# EAGLE design capstoneIO (EAGLE 9.6.2)
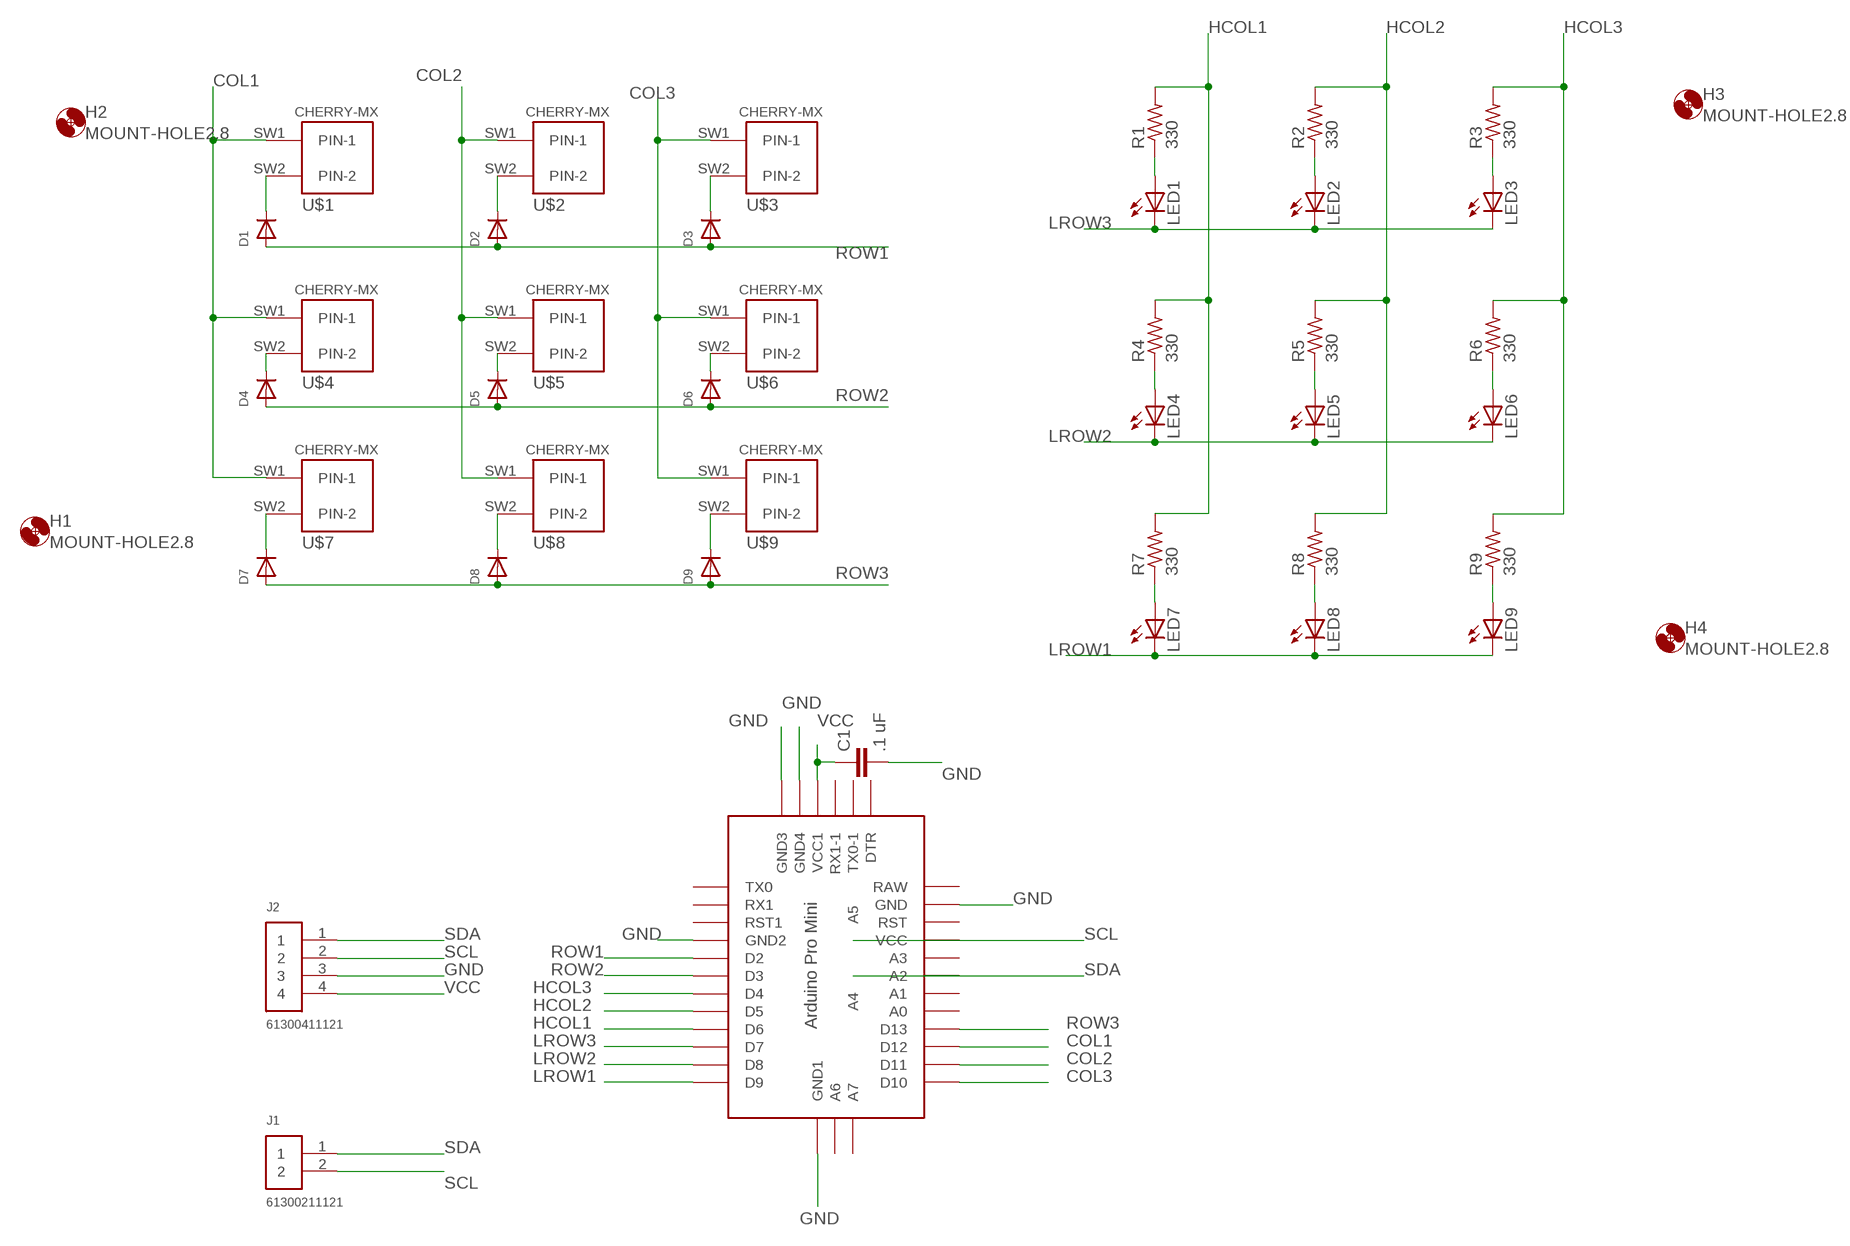
[diagram p0: schematic, sheet 1]

## Parts
C1  .1 uF  C-EU075-032X103-AARON  [C075-032X103-AARON]
D1  DIODEDO-1N4148  [DO-1N4148]
D2  DIODEDO-1N4148  [DO-1N4148]
D3  DIODEDO-1N4148  [DO-1N4148]
D4  DIODEDO-1N4148  [DO-1N4148]
D5  DIODEDO-1N4148  [DO-1N4148]
D6  DIODEDO-1N4148  [DO-1N4148]
D7  DIODEDO-1N4148  [DO-1N4148]
D8  DIODEDO-1N4148  [DO-1N4148]
D9  DIODEDO-1N4148  [DO-1N4148]
H1  MOUNT-HOLE2.8  [2,8]
H2  MOUNT-HOLE2.8  [2,8]
H3  MOUNT-HOLE2.8  [2,8]
H4  MOUNT-HOLE2.8  [2,8]
J1  61300211121  [61300211121]
J2  61300411121  [61300411121]
LED1  LED5MM  [LED5MM]
LED2  LED5MM  [LED5MM]
LED3  LED5MM  [LED5MM]
LED4  LED5MM  [LED5MM]
LED5  LED5MM  [LED5MM]
LED6  LED5MM  [LED5MM]
LED7  LED5MM  [LED5MM]
LED8  LED5MM  [LED5MM]
LED9  LED5MM  [LED5MM]
R1  330  R-US_0204/7  [0204/7]
R2  330  R-US_0204/7  [0204/7]
R3  330  R-US_0204/7  [0204/7]
R4  330  R-US_0204/7  [0204/7]
R5  330  R-US_0204/7  [0204/7]
R6  330  R-US_0204/7  [0204/7]
R7  330  R-US_0204/7  [0204/7]
R8  330  R-US_0204/7  [0204/7]
R9  330  R-US_0204/7  [0204/7]
U$1  CHERRY-MX  [CHERRY-MX]
U$2  CHERRY-MX  [CHERRY-MX]
U$3  CHERRY-MX  [CHERRY-MX]
U$4  CHERRY-MX  [CHERRY-MX]
U$5  CHERRY-MX  [CHERRY-MX]
U$6  CHERRY-MX  [CHERRY-MX]
U$7  CHERRY-MX  [CHERRY-MX]
U$8  CHERRY-MX  [CHERRY-MX]
U$9  CHERRY-MX  [CHERRY-MX]
U$10  ABK-PRO-MINI  [ABK-PRO-MINI]

## Nets
COL1: U$1.SW1(PIN-1) U$4.SW1(PIN-1) U$7.SW1(PIN-1) U$10.D12
COL2: U$2.SW1(PIN-1) U$5.SW1(PIN-1) U$8.SW1(PIN-1) U$10.D11
COL3: U$3.SW1(PIN-1) U$6.SW1(PIN-1) U$9.SW1(PIN-1) U$10.D10
GND: C1.2 J2.3 U$10.GND U$10.GND1(GND2) U$10.GND2(GND3) U$10.GND3(GND4) U$10.GND4(GND1)
HCOL1: R1.2 R4.2 R7.2 U$10.D6
HCOL2: R2.2 R5.2 R8.2 U$10.D5
HCOL3: R3.2 R6.2 R9.2 U$10.D4
LROW1: LED7.K(C) LED8.K(C) LED9.K(C) U$10.D9
LROW2: LED4.K(C) LED5.K(C) LED6.K(C) U$10.D8
LROW3: LED1.K(C) LED2.K(C) LED3.K(C) U$10.D7
N$1: LED1.A R1.1
N$2: LED2.A R2.1
N$3: LED3.A R3.1
N$4: D1.C U$1.SW2(PIN-2)
N$5: LED4.A R4.1
N$6: D3.C U$3.SW2(PIN-2)
N$7: D2.C U$2.SW2(PIN-2)
N$8: D4.C U$4.SW2(PIN-2)
N$9: D5.C U$5.SW2(PIN-2)
N$10: D6.C U$6.SW2(PIN-2)
N$11: LED5.A R5.1
N$12: D7.C U$7.SW2(PIN-2)
N$13: D8.C U$8.SW2(PIN-2)
N$14: D9.C U$9.SW2(PIN-2)
N$15: LED6.A R6.1
N$16: LED7.A R7.1
N$17: LED8.A R8.1
N$18: LED9.A R9.1
ROW1: D1.A D2.A D3.A U$10.D2
ROW2: D4.A D5.A D6.A U$10.D3
ROW3: D7.A D8.A D9.A U$10.D13
SCL: J1.2 J2.2 U$10.A5
SDA: J1.1 J2.1 U$10.A4
VCC: C1.1 J2.4 U$10.VCC1
Unconnected: U$10.A0 U$10.A1 U$10.A2 U$10.A3 U$10.A6 U$10.A7 U$10.DTR U$10.RAW U$10.RST U$10.RST1 U$10.RX1 U$10.RX1-1 U$10.TX0 U$10.TX0-1 U$10.VCC

## Library data of the parts
C1 = aaroncaps:C-EU: CAPACITOR, European symbol
D1-D9 = adafruit:DIODE: Diode SMADIODE - SMA Surface Mount Package 20V 1A Schottky Diode Digikey: 641-1014-6-ND DO-1N4148 - Through Hole Small Current Diode SOD-123 20V 1 A (.5mV Vf) Schottky Diode - Digikey: MBRX120TPMSCT-ND SOD-323 10V 570mA (.38mV Vf, 3ns) Schottky Diode - Digikey: ZLLS410CT-ND SOD-523 30V 30mA Schottky Diode (RB751S-40TE61) - Digikey: RB751S-40TE61CT-ND SOT23-R/W - SOT23 Package (R = Solder Paste/Reflow Ovens, W = Hand-Soldering) BAT54Film 40V 300mA - Digikey: 497-7162-1-ND
H1-H4 = holes:MOUNT-HOLE: MOUNTING HOLE with drill center marker
J1 = Headers:61300211121: CONN HEADER VERT 2POS 2.54MM Manufacturer's datasheet <https://katalog.we-online.de/em/datasheet/6130xx11121.pdf>; CREATED_BY: PCBLayout.com; DIGI_KEY_PART_NUMBER: 732-5315-ND; MANUFACTURER: Wurth Electronics Inc.; MPN: 61300211121
J2 = Headers:61300411121: CONN HEADER VERT 4POS 2.54MM Manufacturer's datasheet <https://katalog.we-online.de/em/datasheet/6130xx11121.pdf>; CREATED_BY: PCBLayout.com; DIGI_KEY_PART_NUMBER: 732-5317-ND; MANUFACTURER: Wurth Electronics Inc.; MPN: 61300411121
LED1-LED9 = adafruit:LED: LED OSRAM: - CHIPLED LG R971, LG N971, LY N971, LG Q971, LY Q971, LO R971, LY R971 LH N974, LH R974 LS Q976, LO Q976, LY Q976 LO Q996 - Hyper CHIPLED LW Q18S LB Q993, LB Q99A, LB R99A - SideLED LS A670, LO A670, LY A670, LG A670, LP A670 LB A673, LV A673, LT A673, LW A673 LH A674 LY A675 LS A676, LA A676, LO A676, LY A676, LW A676 LS A679, LY A679, LG A679 - Hyper Micro SIDELED® LS Y876, LA Y876, LO Y876, LY Y876 LT Y87S - SmartLED LW L88C, LW L88S LB L89C, LB L89S, LG L890 LS L89K, LO L89K, LY L89K LS L896, LA L896, LO L896, LY L896 - TOPLED LS T670, LO T670, LY T670, LG T670, LP T670 LSG T670, LSP T670, LSY T670, LOP T670, LYG T670 LG T671, LOG T671, LSG T671 LB T673, LV T673, LT T673, LW T673 LH T674 LS T676, LA T676, LO T676, LY T676, LB T676, LH T676, LSB T676, LW T676 LB T67C, LV T67C, LT T67C, LS T67K, LO T67K, LY T67K, LW E67C LS E67B, LA E67B, LO E67B, LY E67B, LB E67C, LV E67C, LT E67C LW T67C LS T679, LY T679, LG T679 LS T770, LO T770, LY T770, LG T770, LP T770 LB T773, LV T773, LT T773, LW T773 LH T774 LS E675, LA E675, LY E675, LS T675 LS T776, LA T776, LO T776, LY T776, LB T776 LHGB T686 LT T68C, LB T68C - Hyper Mini TOPLED® LB M676 - Mini TOPLED Santana® LG M470 LS M47K, LO M47K, LY M47K Source: http://www.osram.convergy.de/
R1-R9 = rcl:R-US_: RESISTOR, American symbol; SPICEPREFIX: R
U$1-U$9 = cherrymx:CHERRY-MX: Cherry MX series keyswitch
U$10 = Arduino-clone:ABK-PRO-MINI: ABK Pro-Mini Arduino Clone

## Board
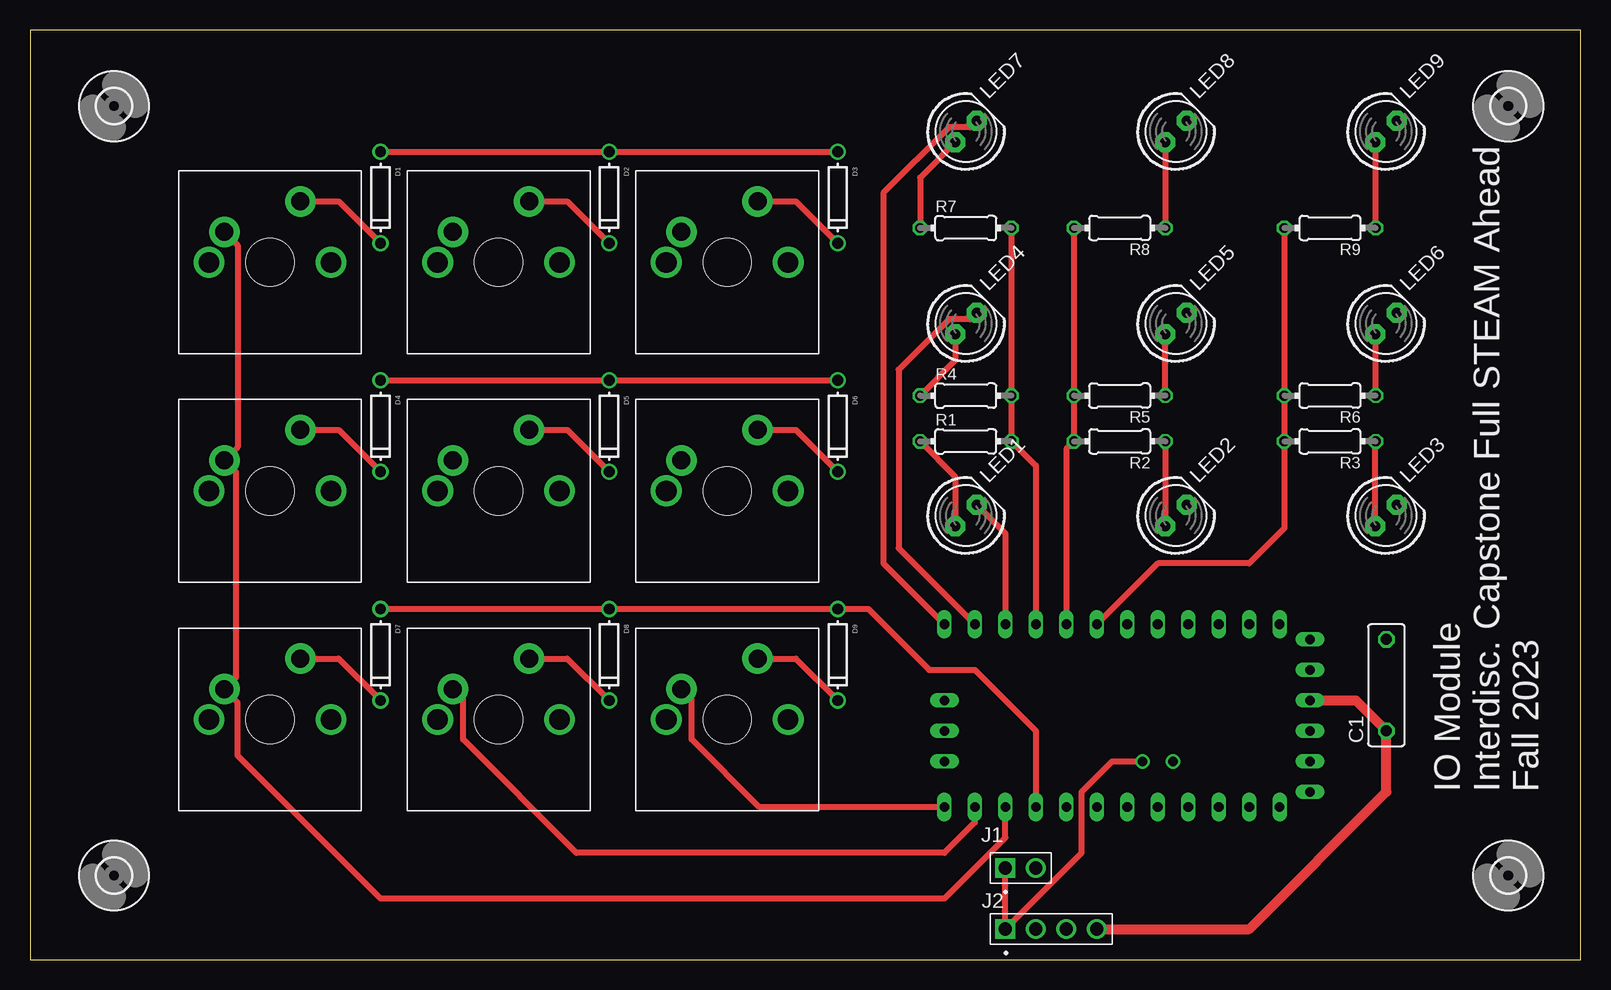
[diagram p1: board, top side]
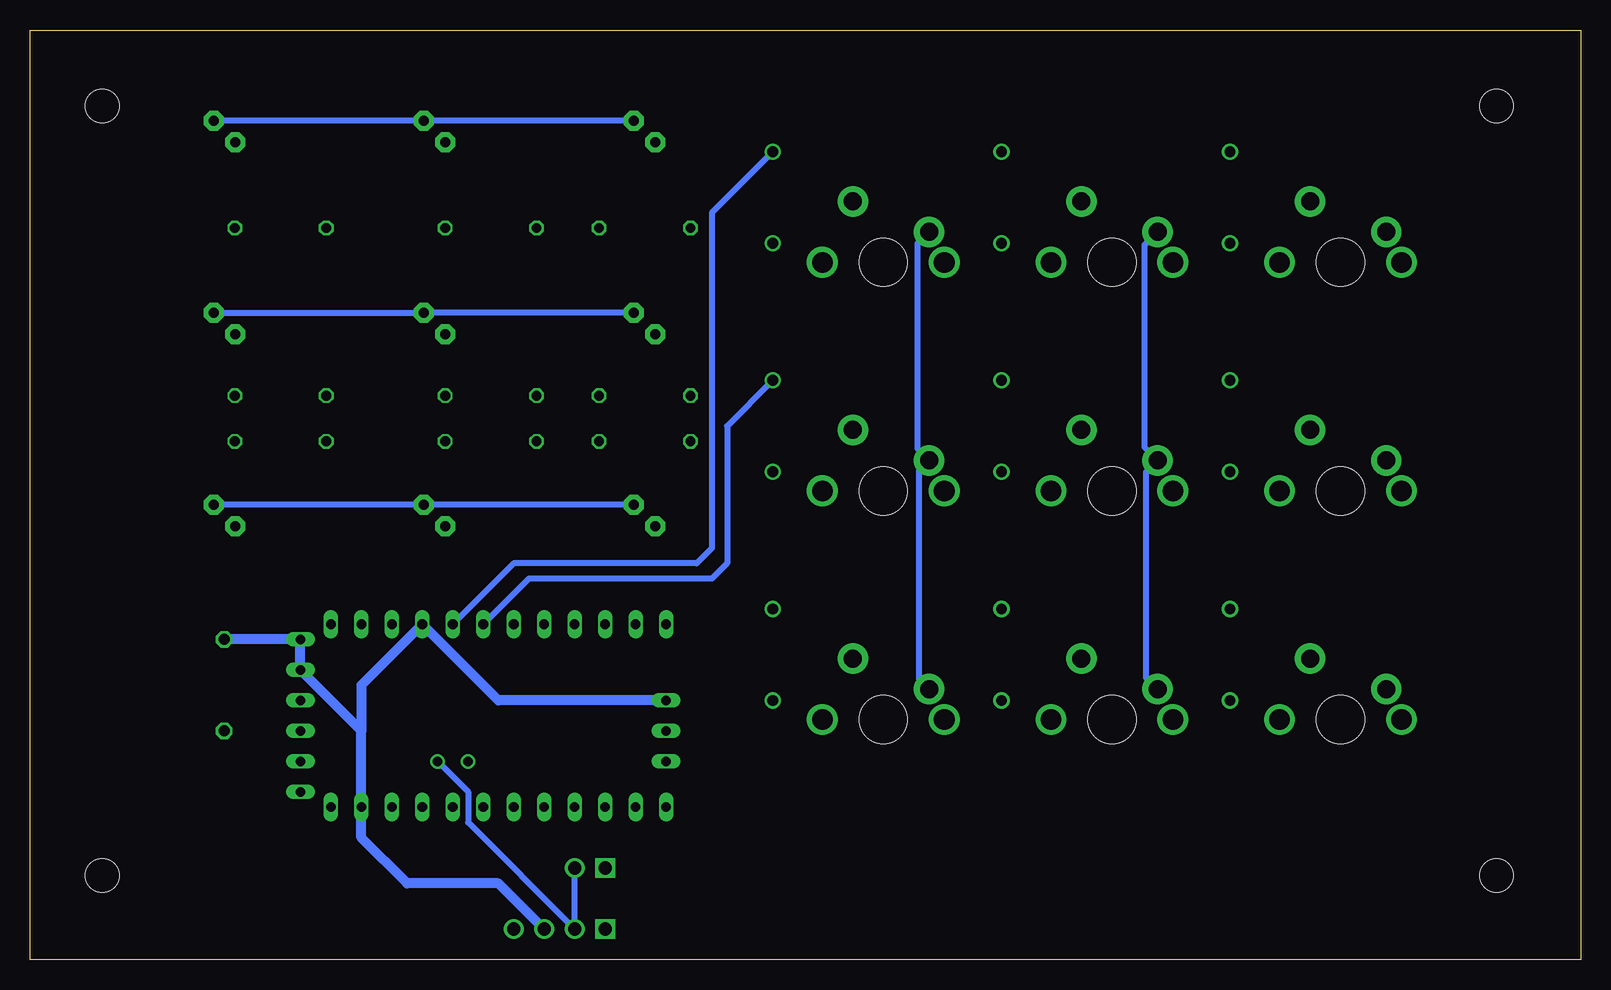
[diagram p2: board, bottom side, seen from below]

Size 129.21 x 77.46 mm. Coordinates in mm from the lower left corner, seen from the top.
Outline: 0,0 129.21,0 129.21,77.46 0,77.46 0,0
Copper layers (1*16): Top 0.035559375mm / dielectric 1.6mm / Bottom 0.035559375mm
Design rules "jlcpcb2layer": minimum track width 5mil, minimum drill 12mil, track to track 5mil, track to pad 5mil, pad to pad 5mil, via to via 5mil, smd to smd 5mil, copper to edge 8mil, drill to drill 6mil, minimum pad ring 5mil, minimum via ring 3mil, stop-mask expansion 2.5mil, vias tented up to drill 0mil, thermal gap 10mil

### Footprints (pad centres in the part's own frame; a part is rotated, then mirrored left to right if it is on the bottom)
C075-032X103-AARON = drill 0.914 octagon: 1 -3.81,0; 2 3.81,0
DO-1N4148 = drill 0.9: A -3.81,0; C 3.81,0
2,8 = hole 2.8: 0,0
61300211121 = drill 1.1 square: 1 -1.27,0 | drill 1.1: 2 1.27,0
61300411121 = drill 1.1 square: 1 -3.81,0 | drill 1.1: 2 -1.27,0; 3 1.27,0; 4 3.81,0
LED5MM = drill 0.813 pad 1.676 octagon: A -1.27,0; K 1.27,0
0204/7 = drill 0.813 octagon: 1 -3.81,0; 2 3.81,0
CHERRY-MX = drill 1.714 pad 1.93: P$3 -5.08,0; P$4 5.08,0 | drill 1.5 pad 2.54: SW1 -3.81,2.54; SW2 2.54,5.08 | hole 4: 0,0
ABK-PRO-MINI = drill 0.8 long: A0 10.16,-3.81; A1 10.16,-6.35; A2 10.16,-8.89; A3 10.16,-11.43; A6 3.81,-21.59; A7 6.35,-21.59; D2 -5.08,-3.81; D3 -5.08,-6.35; D4 -5.08,-8.89; D5 -5.08,-11.43; D6 -5.08,-13.97; D7 -5.08,-16.51; D8 -5.08,-19.05; D9 -5.08,-21.59; D10 10.16,-21.59; D11 10.16,-19.05; D12 10.16,-16.51; D13 10.16,-13.97; DTR 8.89,8.89; GND 10.16,3.81; GND1 -5.08,-1.27; GND2 -3.81,8.89; GND3 -1.27,8.89; GND4 1.27,-21.59; RAW 10.16,6.35; RST 10.16,1.27; RST1 -5.08,1.27; RX1 -5.08,3.81; RX1-1 3.81,8.89; TX0 -5.08,6.35; TX0-1 6.35,8.89; VCC 10.16,-1.27; VCC1 1.27,8.89 | drill 0.8: A4 6.35,-5.08; A5 6.35,-2.54

### Placement (x,y rotation side)
C1  113.03,22.86 90 top
D1  29.21,63.5 270 top
D2  48.26,63.5 270 top
D3  67.31,63.5 270 top
D4  29.21,44.45 270 top
D5  48.26,44.45 270 top
D6  67.31,44.45 270 top
D7  29.21,25.4 270 top
D8  48.26,25.4 270 top
D9  67.31,25.4 270 top
H1  7,7 0 top
H2  123.19,7 0 top
H3  7,71.12 0 top
H4  123.19,71.12 0 top
J1  82.55,7.62 0 top
J2  85.09,2.54 0 top
LED1  78,37 45 top
LED2  95.5,37 45 top
LED3  113,37 45 top
LED4  78,53 45 top
LED5  95.5,53 45 top
LED6  113,53 45 top
LED7  78,69 45 top
LED8  95.5,69 45 top
LED9  113,69 45 top
R1  77.98,43.18 0 top
R2  90.81,43.18 180 top
R3  108.33,43.18 180 top
R4  77.98,46.99 0 top
R5  90.81,46.99 180 top
R6  108.33,46.99 180 top
R7  77.98,60.96 0 top
R8  90.81,60.96 180 top
R9  108.33,60.96 180 top
U$1  20,58.1 0 top
U$2  39.05,58.1 0 top
U$3  58.1,58.1 0 top
U$4  20,39.05 0 top
U$5  39.05,39.05 0 top
U$6  58.1,39.05 0 top
U$7  20,20 0 top
U$8  39.05,20 0 top
U$9  58.1,20 0 top
U$10  97.79,22.86 270 top

### Tracks (layer width: path | path; a pad name or v marks a point on that pad's centre or on a via)
COL1
  Top 0.508: U$10.D12 81.28,10.16 76.2,5.08 29.21,5.08 17.29,17 17.29,21.44 U$7.SW1 17.16,23.52 17.16,40.62 U$4.SW1 17.29,42.69 17.29,59.54 U$1.SW1
COL2
  Top 0.508: U$10.D11 78.74,11.43 76.2,8.89 45.53,8.89 36.09,18.34 36.09,21.69 U$8.SW1
  Bottom 0.508: U$2.SW1 36.34,59.54 36.34,42.69 U$5.SW1 36.22,40.62 36.22,23.52 U$8.SW1
COL3
  Top 0.508: U$10.D10 60.77,12.7 55.14,18.34 55.14,21.69 U$9.SW1
  Bottom 0.508: U$3.SW1 55.27,59.66 55.27,42.56 U$6.SW1 55.14,40.74 55.14,23.39 U$9.SW1
GND
  Bottom 0.813: 101.6,19.05 U$10.GND 101.6,10.16 97.79,6.35 90.17,6.35 J2.3 | 101.6,19.05 U$10.GND3 U$10.GND2 C1.2 | U$10.GND4 90.17,21.59 U$10.GND1 101.6,22.86 101.6,19.05
HCOL1
  Top 0.508: U$10.D6 83.82,41.15 R1.2 R4.2 R7.2
HCOL2
  Top 0.508: R8.2 R5.2 R2.2 86.36,42.55 U$10.D5
HCOL3
  Top 0.508: R9.2 R6.2 R3.2 104.52,35.94 101.6,33.02 93.98,33.02 U$10.D4
LROW1
  Top 0.508: LED7.K 78.35,69.35 76.59,69.35 71.12,63.88 71.12,33.02 U$10.D9
  Bottom 0.508: LED7.K LED8.K LED9.K
LROW2
  Top 0.508: LED4.K 78.35,53.35 76.59,53.35 72.39,49.15 72.39,34.29 U$10.D8
  Bottom 0.508: LED4.K LED5.K LED6.K
LROW3
  Top 0.508: LED1.K 81.28,35.52 U$10.D7
  Bottom 0.508: LED1.K LED2.K LED3.K
N$1
  Top 0.508: R1.1 77.1,40.25 LED1.A
N$2
  Top 0.508: R2.1 94.61,36.12 LED2.A
N$3
  Top 0.508: LED3.A 112.1,43.14 R3.1
N$4
  Top 0.508: U$1.SW2 25.72,63.18 D1.C
N$5
  Top 0.508: LED4.A 77.1,49.92 R4.1
N$6
  Top 0.508: U$3.SW2 63.82,63.18 D3.C
N$7
  Top 0.508: U$2.SW2 44.77,63.18 D2.C
N$8
  Top 0.508: U$4.SW2 25.72,44.13 D4.C
N$9
  Top 0.508: U$5.SW2 44.77,44.13 D5.C
N$10
  Top 0.508: U$6.SW2 63.82,44.13 D6.C
N$11
  Top 0.508: R5.1 94.6,47 LED5.A
N$12
  Top 0.508: U$7.SW2 25.72,25.08 D7.C
N$13
  Top 0.508: U$8.SW2 44.77,25.08 D8.C
N$14
  Top 0.508: U$9.SW2 63.82,25.08 D9.C
N$15
  Top 0.508: R6.1 112.14,52.06 LED6.A
N$16
  Top 0.508: LED7.A 74.17,65.17 R7.1
N$17
  Top 0.508: LED8.A 94.6,60.97 R8.1
N$18
  Top 0.508: LED9.A 112.1,61 R9.1
ROW1
  Top 0.508: D1.A D2.A D3.A
  Bottom 0.508: D3.A 72.39,62.23 72.39,34.29 73.66,33.02 88.9,33.02 U$10.D2
ROW2
  Top 0.508: D4.A D5.A D6.A
  Bottom 0.508: D6.A 71.12,44.45 71.12,33.02 72.39,31.75 87.63,31.75 U$10.D3
ROW3
  Top 0.508: U$10.D13 83.82,19.05 78.74,24.13 74.93,24.13 69.85,29.21 D9.A D8.A D7.A
SCL
  Bottom 0.508: J1.2 J2.2 92.71,11.43 92.71,13.97 U$10.A5
SDA
  Top 0.508: U$10.A4 90.17,16.51 87.63,13.97 87.63,8.89 J2.1 J1.1
VCC
  Top 0.813: U$10.VCC1 110.49,21.59 C1.1 113.03,13.97 101.6,2.54 J2.4

### Text on the board
tPlace: IO Module / Interdisc. Capstone Full STEAM Ahead / Fall 2023